# Altium project Semester4Project.PrjPcb
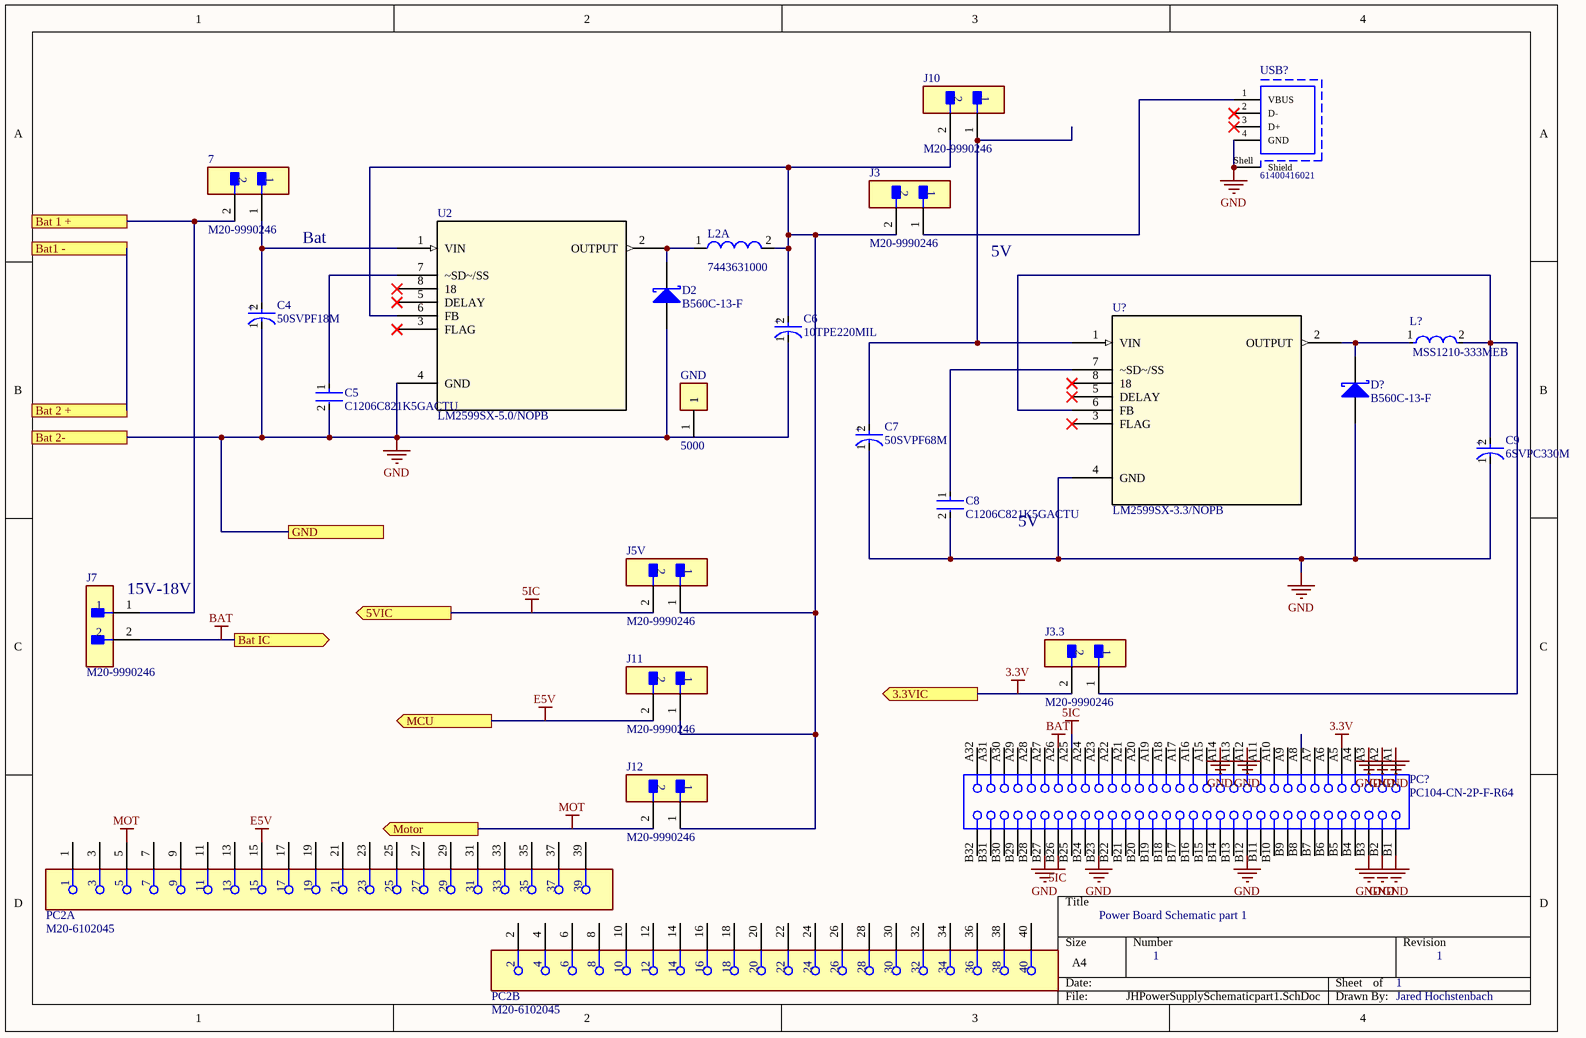
[diagram p0: JHPowerSupplySchematicpart1.SchDoc]
1 sheet, 24 parts. Net scope: flat (ports and power ports of the same name join across sheets).
Board file: JHPowerSupplyPCBPart1.PcbDoc

## Sheet JHPowerSupplySchematicpart1.SchDoc
size A4; SheetNumber: 1; SheetTotal: 1

### Parts
7  M20-9990246  [FP-M20-9990246-MFG]
C4  50SVPF18M  [FP-OS-CON-SMT-E7-MFG]
C5  C1206C821K5GACTU  [FP-C1206C-EB-MFG]
C6  10TPE220MIL  [FP-POSCAP-D3L-MFG]
C7  50SVPF68M  [FP-OS-CON-SMT-F12-MFG]
C8  C1206C821K5GACTU  [FP-C1206C-EB-MFG]
C9  6SVPC330M  [FP-OS-CON-SMT-C6-MFG]
D2  B560C-13-F  [DIOD-B5X0C-2_M]
D?  B560C-13-F  [DIOD-B5X0C-2_M]
GND  5000  [FP-5000-MFG]
J3  M20-9990246  [FP-M20-9990246-MFG]
J3.3  M20-9990246  [FP-M20-9990246-MFG]
J5V  M20-9990246  [FP-M20-9990246-MFG]
J7  M20-9990246  [FP-M20-9990246-MFG]
J10  M20-9990246  [FP-M20-9990246-MFG]
J11  M20-9990246  [FP-M20-9990246-MFG]
J12  M20-9990246  [FP-M20-9990246-MFG]
L2  7443631000  [WE-HCF-2013]  (part A of 2)
L?  MSS1210-333MEB  [FP-MSS1210-333MEB-MFG]
PC2  M20-6102045  [FP-M20-6102045-MFG]  (parts A,B of 2)
PC?  PC104-CN-2P-F-R64  [BTB2-54-V64F-04]
U2  LM2599SX-5.0/NOPB  [TS7B]
U?  LM2599SX-3.3/NOPB  [TS7B]
USB?  61400416021  [61400416021]

### Ports
3.3VIC (out), 5VIC (out), Bat1 -, Bat 1 +, Bat 2 +, Bat 2-, Bat IC (out), GND, MCU (out), Motor (out)

### Nets
3.3V: J3.3.2 PC?.A5 ; port 3.3VIC
5IC: J5V.2 PC?.A25 PC?.B26 ; port 5VIC
BAT: J7.2 PC?.A26 ; port Bat IC
E5V: J11.2 PC2.15 ; port MCU
GND: C4.1(C) C5.2 C6.1(C) C7.1(C) C8.2 C9.1(C) D2.2(A) D?.2(A) GND.1 PC?.A1 PC?.A2 PC?.A3 PC?.A12 PC?.A14 PC?.B1 PC?.B2 PC?.B3 PC?.B12 PC?.B23 PC?.B27 U2.4(GND) U?.4(GND) USB?.4(GND) USB?.Shell(Shield) ; port GND, port Bat 2-
MOT: J12.2 PC2.5 ; port Motor
Net7_1: 7.1 C4.2(A) U2.1(VIN)
Net7_2: 7.2 J7.1 ; port Bat 1 +
NetC5_1: C5.1 U2.7(~SD~/SS)
NetC6_2: C6.2(A) J3.2 J5V.1 J10.2 J11.1 J12.1 L2.2 U2.6(FB)
NetC7_2: C7.2(A) J10.1 U?.1(VIN)
NetC8_1: C8.1 U?.7(~SD~/SS)
NetC9_2: C9.2(A) J3.3.1 L?.2 U?.6(FB)
NetD2_1: D2.1(K) L2.1 U2.2(OUTPUT)
NetD?_1: D?.1(K) L?.1 U?.2(OUTPUT)
NetJ3_1: J3.1 USB?.1(VBUS)
(unnamed): port Bat1 -, port Bat 2 +

Not connected (* = marked no-connect by the designer): PC2 1 2 3 4 6 7 8 9 10 11 12 13 14 16 17 18 19 20 21 22 23 24 25 26 27 28 29 30 31 32 33 34 35 36 37 38 39 40; PC? A4(4) A6(6) A7(7) A8(8) A9(9) A10(10) A11(11) A13(13) A15(15) A16(16) A17(17) A18(18) A19(19) A20(20) A21(21) A22(22) A23(23) A24(24) A27(27) A28(28) A29(29) A30(30) A31(31) A32(32) B4(36) B5(37) B6(38) B7(39) B8(40) B9(41) B10(42) B11(43) B13(45) B14(46) B15(47) B16(48) B17(49) B18(50) B19(51) B20(52) B21(53) B22(54) B24(56) B25(57) B28(60) B29(61) B30(62) B31(63) B32(64); U2 3(FLAG)* 5(DELAY)* 8(18)*; U? 3(FLAG)* 5(DELAY)* 8(18)*; USB? 2(D-)* 3(D+)*

### Notes on the sheet
- Bat
- 5V
- (near J7) 15V-18V
- Power Board Schematic part 1
- 1
- Jared Hochstenbach
- (in symbol CMP-05428-000285-1) +
- (in symbol CMP-05428-000339-1) +
- (in symbol CMP-05428-000631-1) +
- (in symbol CMP-05428-000913-1) +

### Library data of the parts
7 J3 J3.3 J5V J7 J10-J12 = CMP-15831-000009-1: CONN HEADER VERT 2POS 2.54MM; Manufacturer: Harwin; Conn Gender: Male; Conn Orientation: Vertical; Number Of Contacts: 2; Current Rating: 3A; ComponentLink2URL: https://cdn.harwin.com/pdfs/M20-999.pdf; ComponentLink2Description: Datasheet; Package: M20-9990246; Temperature: -40°C to +105°C; Octopart: https://octopart.com/m20-9990246-harwin-2590635; Mouser Description: 2.54mm (0.1") Pitch SIL Vertical PC Tail Pin Header, 6.1mm mating pin height, tin, 2 contacts; Temperature Range High: +105°C; Device Class L1: Connectors; RoHS: TRUE; Automotive: No; Height: 8.99mm; Number Of Rows: 1; Contact Material: Tin,Nickel; Category: Conn; Pitch: 2.54mm; Lead Free: Yes; Digikey Description: CONN HEADER VERT 2POS 2.54MM; Manufacturer Part Number: M20-9990246; Temperature Range Low: -40°C; Device Class L3: unset; Device Class L2: Headers and Wire Housings
C4 = CMP-05428-000339-1: Conductive Polymer Aluminum Solid Capacitors (OS-CON) 18uF ±20% 50V RADIAL SMT 8x6.9mm; Ripple Current (AC): 2.7A; Life (Hours): 5000Hour; Dissipation Factor: 12%; Polarity: Polar; ESR (Equivalent Series Resistance): 35mR; Leakage Current: 180uA; Voltage: 50V; REACH SVHC: No SVHC; Capacitance: 18uF; Height - Seated (Max): 0.276inch; Series: OS-CON™, SVPF; Length: 6.9mm; Termination: SMD/SMT; Voltage Rating (DC): 50V; Package Quantity: 1000; Number of Pins: 7; Weight: 0.021164oz; Max Operating Temperature: 105°C; Min Operating Temperature: -55°C; Case/Package: Radial; Height: 6.9mm; Mount: Surface Mount; Ripple Current: 2.7A; Voltage Rating: 50V; Tolerance: 20%; Packaging: Cut Tape; RoHS Compliant: Yes; Diameter: 8mm
C5 C8 = CMP-03020-020553-1: CAP CER 820PF 50V C0G/NP0 1206; Manufacturer: KEMET; Material: Ceramic; Temperature Characteristic: C0G; Temperature Coefficient: 15%; Tolerance: 0.1; Automotive Grade: Grade 0; Lead Free: Yes; Height: 0.88mm; Category: Cap; Voltage Rating: 50 V; Temperature Range High: +150°C; Device Class L3: Ceramic Capacitors; Device Class L1: Passive Components; ComponentLink2Description: Datasheet; Package: C1206C-EB; Automotive: Yes; Temperature Range Low: -55°C; Octopart: https://octopart.com/c1206c821k5gactu-kemet-125661; Capacitance: 820 pF; Digikey Description: CAP CER 820PF 50V C0G/NP0 1206; ComponentLink2URL: https://content.kemet.com/datasheets/KEM_C1007_X8R_ULTRA_150C_SMD.pdf; Temperature: -55°C to +150°C; Value: 820 pF; RoHS: TRUE; Ipc Land Pattern Name: CAPC320160X78; Mouser Description: Multilayer Ceramic Capacitors MLCC - SMD/SMT 50volts 820pF C0G 10%; Manufacturer Part Number: C1206C821K5GACTU; Device Class L2: Capacitors
C6 = CMP-05428-000285-1: Molded Tantalum Polymer Capacitor 220uF 20% 10V life 2000Hours SMD 2917; Ripple Current: 2.8A; Polarity: Polar; ESR (Equivalent Series Resistance): 18mR; Dissipation Factor: 10%; Leakage Current: 220uA; Capacitance: 220uF; Length: 7.3mm; REACH SVHC: No SVHC; RoHS Compliant: Yes; Case Code (Metric): 7343; Case Code (Imperial): 2917; Construction: Flat; Voltage Rating: 10V; Width: 0.169inch; Lead Free: Lead Free; Series: POSCAP™ TPE; Case/Package: 2917; Features: General Purpose; Height: 2.8mm; Mount: Surface Mount; Radiation Hardening: No; Depth: 4.3mm; Max Operating Temperature: 105°C; Package Quantity: 2500; Height - Seated (Max): 0.118inch; Voltage Rating (DC): 10V; Termination: SMD/SMT; Tolerance: 20%; Packaging: Tape and Reel; Voltage: 10V; Min Operating Temperature: -55°C
C7 = CMP-05428-000631-1: Conductive Polymer Aluminum Solid Capacitors (OS-CON) 68uF ±20% 50V RADIAL SMT 10x12.6mm; Leakage Current: 680uA; Life (Hours): 5000Hour; Dissipation Factor: 12%; Ripple Current (AC): 4.3A; ESR (Equivalent Series Resistance): 20mR; Polarity: Polar; Diameter: 10mm; Capacitance: 68uF; Min Operating Temperature: -55°C; Construction: Cylindrical; Tolerance: 20%; Voltage Rating: 50V; Case/Package: Radial; Mount: Surface Mount; Max Operating Temperature: 105°C; RoHS Compliant: Yes; Height - Seated (Max): 0.5inch; Termination: SMD/SMT; Voltage Rating (DC): 50V; Packaging: Tape and Reel; Length: 12.6mm; Package Quantity: 400; Number of Pins: 12; Lead Free: Lead Free; Height: 12.6mm; REACH SVHC: No SVHC; Ripple Current: 4.3A; Series: OS-CON™, SVPF; Voltage: 50V
C9 = CMP-05428-000913-1: Conductive Polymer Aluminum Solid Capacitors (OS-CON) 330uF ±20% 6.3V; Ripple Current: 3.39A; ESR (Equivalent Series Resistance): 17mR; Life (Hours): 2000Hour; Leakage Current: 415uA; Polarity: Polar; Dissipation Factor: 12%; Height - Seated (Max): 0.236inch; Voltage Rating (DC): 6.3V; Capacitance: 330uF; Package Quantity: 1000; Radiation Hardening: No; Case/Package: Radial; Packaging: Tape and Reel; Tolerance: 20%; Diameter: 6.3mm; Voltage Rating: 6.3V; Construction: Cylindrical; Ripple Current (AC): 3.39A; Voltage: 6.3V; RoHS Compliant: Yes; Series: OS-CON™, SVPC; Min Operating Temperature: -55°C; Mount: Surface Mount; Number of Pins: 6; REACH SVHC: No SVHC; Length: 5.9mm; Max Operating Temperature: 105°C; Height: 5.9mm; Lead Free: Lead Free; Termination: SMD/SMT
D2 D? = CMP-2000-05098-2: Schottky Barrier Rectifier, 5 A, 60 V, -55 to 125 degC, 2-Pin SMD, RoHS, Tape and Reel; Ir - Reverse Current: 500uA; Configuration: Single; Ifsm - Forward Surge Current: 100A; Vrrm - Repetitive Reverse Voltage: 60V; Brand: DiodesIncorporated; Vf - Forward Voltage: 0.7V; If - Forward Current: 5A; Unit Weight: 0.007408oz; Type: SchottkyBarrierRectifier; Package / Case: SMC; Manufacturer URL: http://www.diodes.com/; Datasheet URL: https://datasheet.ciiva.com/27052/1538961-27052355.pdf; Factory Pack Quantity: 3000; Height: 2.5mm; Width: 6.22mm; Product Category: SchottkyDiodes&Rectifiers; Minimum Operating Temperature: -55C; Manufacturer: DiodesIncorporated; Datasheet Version: Rev. 7-2, 06/2007; Product: SchottkyDiodes; Maximum Operating Temperature: +125C; Operating Temperature Range: -55Cto+125C; Technology: Si; Length: 7.11mm; RoHS: True; Packaging: Reel; Termination Style: SMD/SMT; Series: B560; Mounting Style: SMD/SMT
GND = CMP-19636-000027-1: PC TEST POINT MINIATURE RED; Outside Diameter: 2.54mm; Body Material: Bronze; Number of Contacts: 1; Insulation: Insulated; Inside Diameter: 1.27mm; Hole Diameter: 1.6mm; Plating: Silver; Length: 7.62mm; Package Quantity: 100; Number of Ports: 1; Contact Material: Bronze; Orientation: Straight; RoHS Compliant: Yes; Housing Color: Red; Height: 0.3inch; Series: THM; Lead Free: Lead Free; Color: Red; Contact Plating: Tin; Mount: PCB; Packaging: Bulk; REACH SVHC: No SVHC; Flammability Rating: UL94 V-0; Material: Nylon
L2 = CMP-0226-00157-1: SMD High Current Inductor WE-HCF, L=10.0 µH; Inductance: 10.0 ÂµH; DatasheetVersion: ver 1, Jul-2009; PackageReference: WE-HCF-2013; ComponentLink1URL: http://www.we-online.com; ComponentLink2Description: Datasheet; ComponentLink1Description: Manufacturer Link; PackageVersion: 2009; PackageDescription: SMD Inductor, 3-Leads, Body 21.5 x 21.0 mm; ComponentLink2URL: http://www.we-online.de/katalog/media/pdf/7443631000.pdf
L? = CMP-11268-000051-1: Fixed Inductor MSS1210 AEC-Q200 33 uH 20 % 5.9 A; Test Frequency: 100kHz; Self Resonant Frequency: 7.5MHz; Inductance: 33uH; Core Material: Ferrite; Max DC Current: 5.9A; Tolerance: 20%; Shielding: Shielded; Saturation Current: 5.4A; DC Resistance (DCR): 39mR; Height: 10.2mm; Max Operating Temperature: 85°C; Mount: Surface Mount; Package Quantity: 25; Packaging: Tape and Reel; Termination: SMD/SMT; Lead Free: Contains Lead; Length: 12.3mm; Inductance Tolerance: 20%; REACH SVHC: No SVHC; Width: 12.3mm; Min Operating Temperature: -40°C; RMS Current (Irms): 5.9A
PC2 = CMP-15831-000080-1: CONN STKTHRU PC/104 40POS PCB; Current Rating: 3A; Pitch: 2.54mm; Insulation Resistance: 5GR; Contact Resistance: 30mR; Number of Positions: 40; Gender: Receptacle; REACH SVHC: No SVHC; Housing Material: Nylon; Number of Rows: 2; Min Operating Temperature: -55°C; Contact Plating: Gold; Orientation: Straight; Mount: Through Hole; Contact Material: Bronze; Length: 51.46mm; Weight: 0.218205oz; Number of Contacts: 40; Packaging: Rail/Tube; Depth: 5.25mm; Termination: Solder; Radiation Hardening: No; Flammability Rating: UL94 V-0; Housing Color: Black; Max Operating Temperature: 105°C; Material: Nylon; Package Quantity: 11; Color: Black; Max Current Rating: 3A; Series: M20
PC? = CMP-0001-00110-1: Board-to-Board Connector, PC104 BA ISA, Stackthrough, Vertical, 2-Row, 64-Postion, Pitch 2.54mm,  Receptacle, Height 11.05mm; Mating Connector: Harwin-M20-6103205 (stackthrough); Publisher: Altium; ClassName: Board Template Connector; Component Kind: Standard; Package Reference: BTB2-54-V64F-04
U2 = LM2599SX-5.0/NOPB: No Description Available; Mfr_Name: Texas Instruments; Type: DEV; Copyright: Copyright (C) 2023 Ultra Librarian. All rights reserved.; Manufacturer_Part_Number: LM2599SX-5.0/NOPB; RefDes: RefDes
U? = LM2599SX-3.3/NOPB: No Description Available; Mfr_Name: Texas Instruments; Type: DEV; Copyright: Copyright (C) 2023 Ultra Librarian. All rights reserved.; Manufacturer_Part_Number: LM2599SX-3.3/NOPB; RefDes: RefDes
USB? = CMP-1502-03227-1: USB 2.0 Type A Receptacle WR-COM, Horizontal, THT; Manufacturer: Wurth Elektronik; Working Voltage: 30VAC; Rated Current: 1.5A; Contact Resistance: 20mOhm; Manufacturer URL: http://www.we-online.de; Publisher: WurthElektronik; Packaging: Tray; Operating Temperature: -40to105degC; Orientation: Horizontal; Mounting Technology: THT; Part Number: 61400416021; Gender: Receptacle; Package Reference: 61400416021; Connector Type: USB2.0TypeA; Datasheet URL: https://katalog.we-online.de/em/datasheet/61400416021.pdf